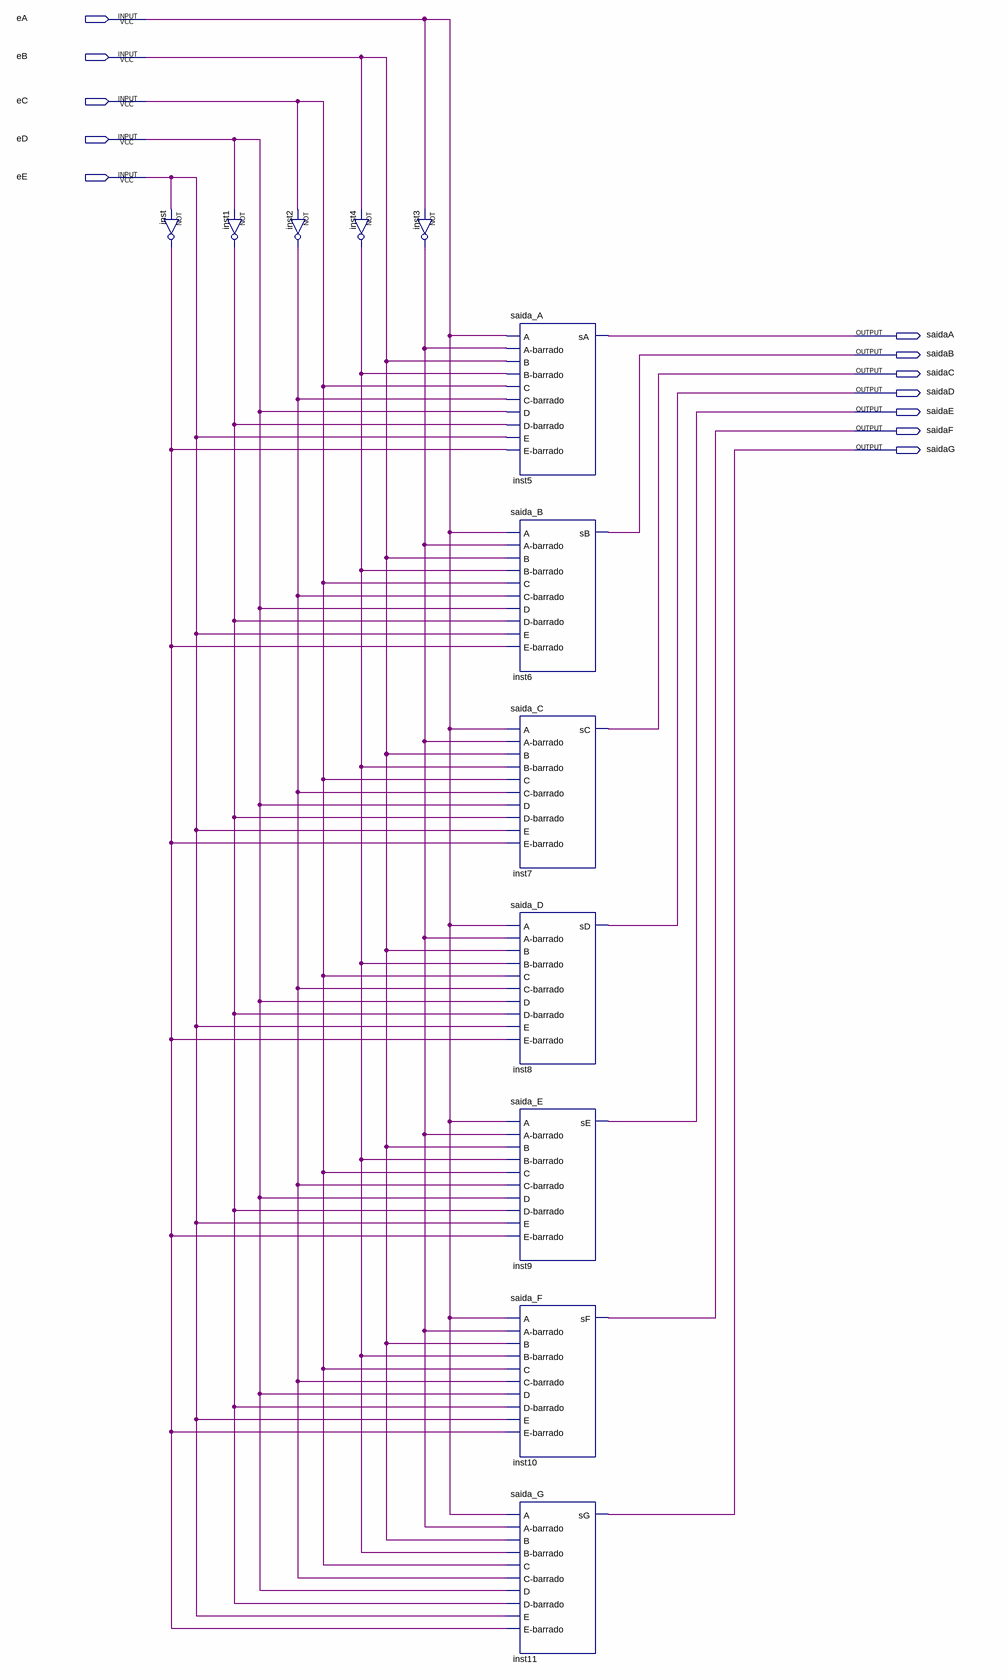
[diagram p0: schematic sheet]
// Quartus schematic decodificador.bdf as structural Verilog: 12 symbols, 12 pins
module decodificador (
  input  eA,
  input  eB,
  input  eC,
  input  eD,
  input  eE,
  output saidaA,
  output saidaB,
  output saidaC,
  output saidaD,
  output saidaE,
  output saidaF,
  output saidaG
);

  wire inst1_out, inst2_out, inst3_out, inst4_out, inst_out;

  not inst (inst_out, eE);
  not inst1 (inst1_out, eD);
  not inst2 (inst2_out, eC);
  not inst4 (inst4_out, eB);
  not inst3 (inst3_out, eA);
  saida_A inst5 (
    .A(eA), .\A-barrado (inst3_out), .B(eB), .\B-barrado (inst4_out), .C(eC), .\C-barrado (inst2_out),
    .D(eD), .\D-barrado (inst1_out), .E(eE), .\E-barrado (inst_out), .sA(saidaA));
  saida_B inst6 (
    .A(eA), .\A-barrado (inst3_out), .B(eB), .\B-barrado (inst4_out), .C(eC), .\C-barrado (inst2_out),
    .D(eD), .\D-barrado (inst1_out), .E(eE), .\E-barrado (inst_out), .sB(saidaB));
  saida_C inst7 (
    .A(eA), .\A-barrado (inst3_out), .B(eB), .\B-barrado (inst4_out), .C(eC), .\C-barrado (inst2_out),
    .D(eD), .\D-barrado (inst1_out), .E(eE), .\E-barrado (inst_out), .sC(saidaC));
  saida_D inst8 (
    .A(eA), .\A-barrado (inst3_out), .B(eB), .\B-barrado (inst4_out), .C(eC), .\C-barrado (inst2_out),
    .D(eD), .\D-barrado (inst1_out), .E(eE), .\E-barrado (inst_out), .sD(saidaD));
  saida_E inst9 (
    .A(eA), .\A-barrado (inst3_out), .B(eB), .\B-barrado (inst4_out), .C(eC), .\C-barrado (inst2_out),
    .D(eD), .\D-barrado (inst1_out), .E(eE), .\E-barrado (inst_out), .sE(saidaE));
  saida_F inst10 (
    .A(eA), .\A-barrado (inst3_out), .B(eB), .\B-barrado (inst4_out), .C(eC), .\C-barrado (inst2_out),
    .D(eD), .\D-barrado (inst1_out), .E(eE), .\E-barrado (inst_out), .sF(saidaF));
  saida_G inst11 (
    .A(eA), .\A-barrado (inst3_out), .B(eB), .\B-barrado (inst4_out), .C(eC), .\C-barrado (inst2_out),
    .D(eD), .\D-barrado (inst1_out), .E(eE), .\E-barrado (inst_out), .sG(saidaG));
endmodule
